# Altium schematic sheet [05] - DOC HISTORICO REVISAO.SchDoc
size A3; DocumentNumber: 5; SheetNumber: 5; SheetTotal: 6
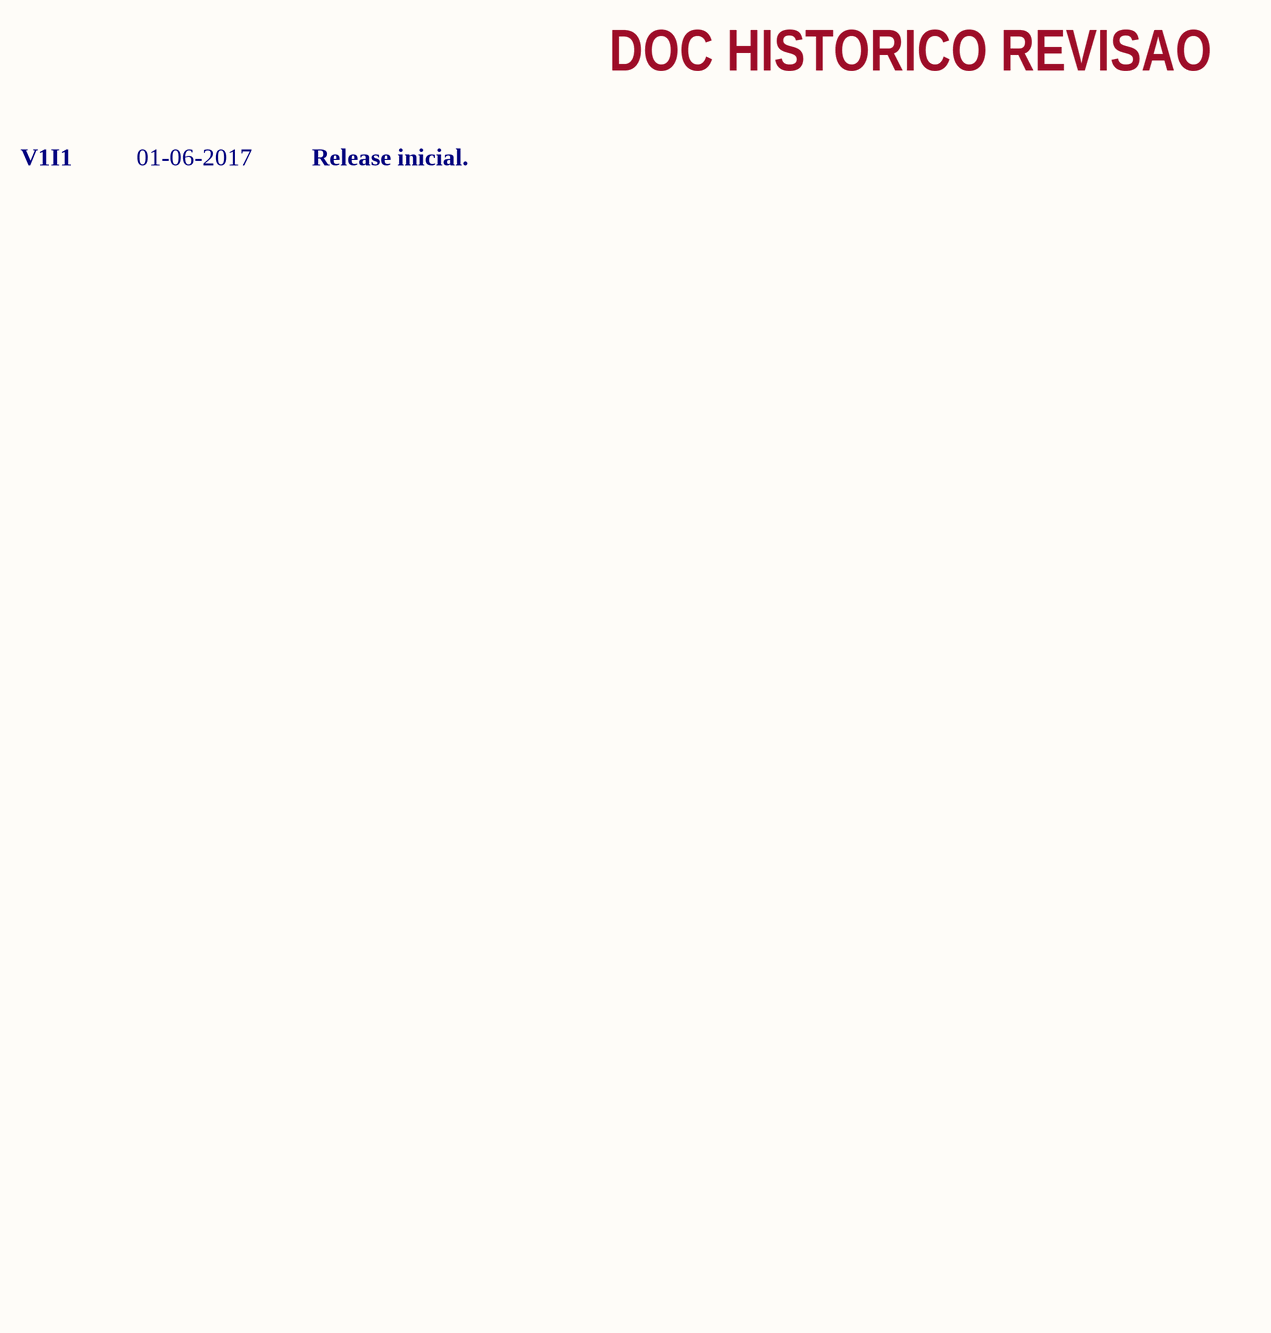
[diagram p0: [05] - DOC HISTORICO REVISAO.SchDoc]

## Notes on the sheet
- DOC HISTORICO REVISAO
- V1I1
- 01-06-2017
- Release inicial.
- CLOCKS (CPU & PCIE)
- Projeto:
- Ancient Egypt Ltda
- Revisão:
- Engenheiro:
- Titulo:
- Pág
- de
- Pyramides of Giza, 777
- Cairo
- www.ancientegypt.com.eg
- Data:
- Hora:
- Variante: